# EAGLE design 15-15 AC_DC_Dual_power_supply (EAGLE 9.6.2)
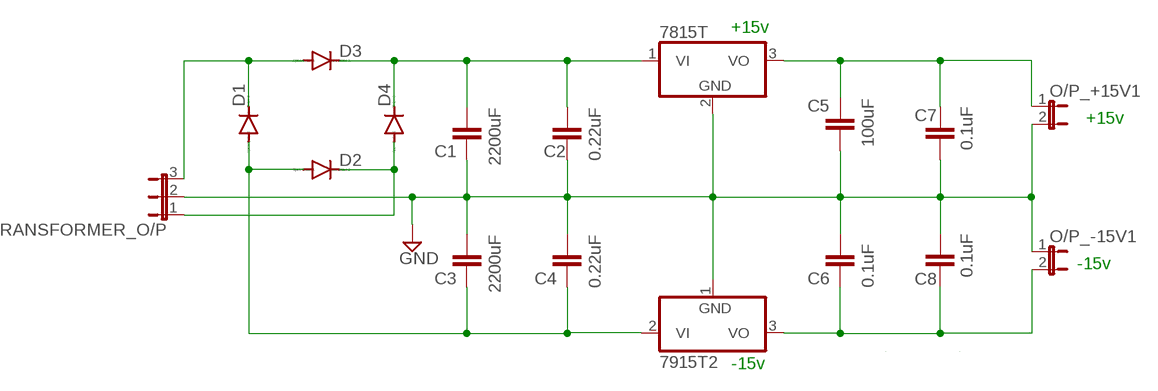
[diagram p0: schematic, sheet 1]

## Parts
7915T2  7915T  [TO220H]
+15V2  7815T  [TO220H]
C1  2200uF  C2.5/2  [C2.5-2]
C2  0.22uF  C2.5/2  [C2.5-2]
C3  2200uF  C2.5/2  [C2.5-2]
C4  0.22uF  C2.5/2  [C2.5-2]
C5  100uF  C2.5/2  [C2.5-2]
C6  0.1uF  C2.5/2  [C2.5-2]
C7  0.1uF  C2,5-3  [C2.5-3]
C8  0.1uF  C2,5-3  [C2.5-3]
D1  1N4004  [DO41-10]
D2  1N4004  [DO41-10]
D3  1N4004  [DO41-10]
D4  1N4004  [DO41-10]
O/P_+15V1  JP1E  [JP1]
O/P_-15V1  JP1E  [JP1]
TRANSFORMER_O/P  JP2E  [JP2]

## Nets
GND: 7915T2.1(GND) +15V2.2(GND) C1.1 C2.1 C3.2 C4.2 C5.1 C6.2 C7.2 C8.1 TRANSFORMER_O/P.2
N$3: +15V2.1(VI) C1.2 C2.2 D3.C D4.C
N$7: +15V2.3(VO) C5.2 C7.1 O/P_+15V1.1
N$8: 7915T2.3(VO) C6.1
N$9: C8.2 O/P_-15V1.2
N$10: 7915T2.2(VI) C3.1 C4.1 D1.A D2.A
N$13: D2.C D4.A TRANSFORMER_O/P.1
N$19: O/P_+15V1.2 O/P_-15V1.1
N$20: D1.C D3.A TRANSFORMER_O/P.3

## Notes on the sheet
- +15v
- +15v
- -15v
- -15v

## Library data of the parts
7915T2 = linear:79*: Negative VOLTAGE REGULATOR
+15V2 = linear:78*: Positive VOLTAGE REGULATOR Source: http://cache.national.com/ds/LM/LM78L05.pdf http://www.fairchildsemi.com/ds/LM/LM7805.pdf
C1-C8 = capacitor-wima:C: CAPACITOR naming: grid - package width
D1-D4 = diode:1N4004: DIODE general purpose rectifier, 1 A
O/P_+15V1 O/P_-15V1 = jumper:JP1E: JUMPER
TRANSFORMER_O/P = jumper:JP2E: JUMPER

## Board
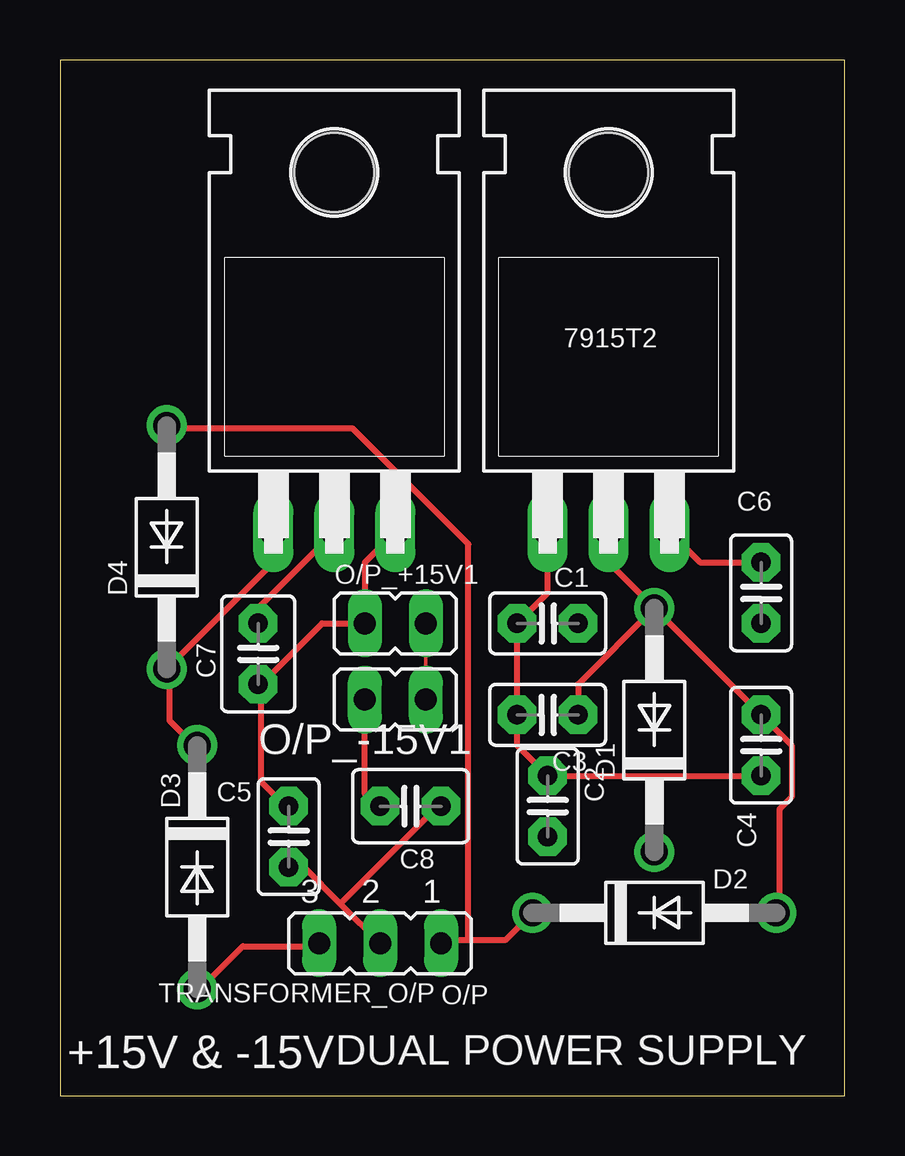
[diagram p1: board, top side]
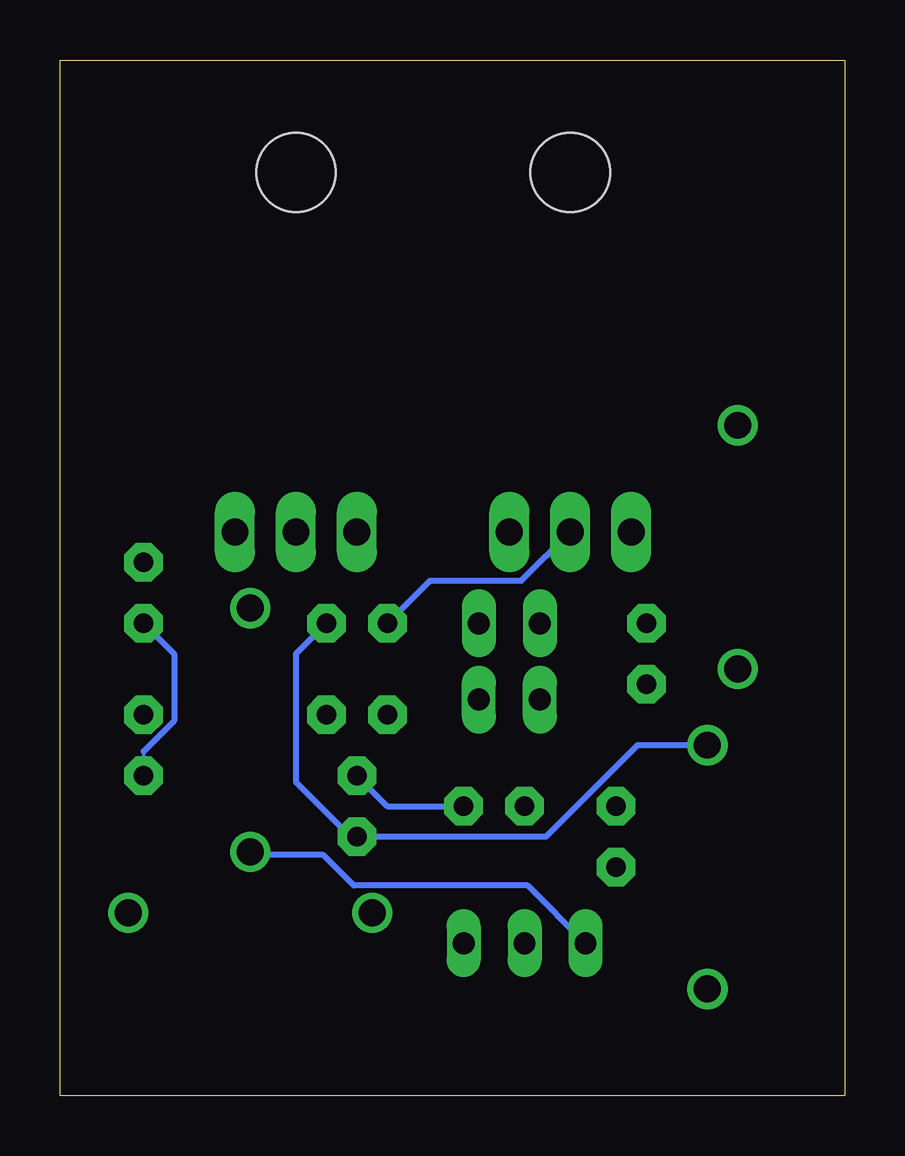
[diagram p2: board, bottom side, seen from below]

Size 32.69 x 43.17 mm. Coordinates in mm from the lower left corner, seen from the top.
Outline: 0,0 32.69,0 32.69,43.17 0,43.17 0,0
Copper layers (1*16): Top 0.035mm / dielectric 1.5mm / Bottom 0.035mm
Design rules "default": minimum track width 6mil, minimum drill 0.35mm, track to track 6mil, track to pad 6mil, pad to pad 6mil, via to via 6mil, smd to smd 6mil, copper to edge 40mil, drill to drill 6mil, minimum pad ring 10mil, minimum via ring 8mil, stop-mask expansion 4mil, vias tented up to drill 0mil, thermal gap 10mil

### Footprints (pad centres in the part's own frame; a part is rotated, then mirrored left to right if it is on the bottom)
TO220H = drill 1.118 long: 1 -2.54,-10.16; 2 0,-10.16; 3 2.54,-10.16 | hole 3.302: 0,4.826
C2.5-2 = drill 0.813 pad 1.6 octagon: 1 -1.27,0; 2 1.27,0
C2.5-3 = drill 0.813 pad 1.6 octagon: 1 -1.27,0; 2 1.27,0
DO41-10 = drill 1.118: A 5.08,0; C -5.08,0
JP1 = drill 0.914 long: 1 0,-1.27; 2 0,1.27
JP2 = drill 0.914 long: 1 -2.54,0; 2 0,0; 3 2.54,0

### Placement (x,y rotation side)
7915T2  22.86,33.66 0 top
+15V2  11.43,33.66 0 top
C1  20.32,19.68 0 top
C2  20.32,12.07 270 top
C3  20.32,15.88 180 top
C4  29.21,14.61 270 top
C5  9.53,10.79 90 top
C6  29.21,20.96 270 top
C7  8.26,18.42 90 top
C8  14.61,12.07 180 top
D1  24.77,15.24 90 top
D2  24.77,7.62 0 top
D3  5.71,9.52 270 top
D4  4.45,22.86 90 top
O/P_+15V1  13.97,19.68 270 top
O/P_-15V1  13.97,16.51 90 top
TRANSFORMER_O/P  13.34,6.35 180 top

### Tracks (layer width: path | path; a pad name or v marks a point on that pad's centre or on a via)
GND
  Top 0.152: 8.38,20.45 8.38,19.68 C7.2 | 15.75,12.07 C8.1
  Top 0.254: +15V2.2 8.38,20.45 | 11.68,8 10.16,9.52 C5.1 | 11.68,8 TRANSFORMER_O/P.2 | 7915T2.1 20.32,20.96 C1.1 C3.2 19.05,14.61 C2.1 C4.2 | 15.75,12.07 11.68,8
  Bottom 0.152: 29.21,14.35 C4.2
  Bottom 0.254: 29.21,14.35 27.94,15.62 27.94,18.42 C6.2 | C8.1 19.05,12.07 C2.1 | +15V2.2 13.46,21.46 17.27,21.46 C1.1
N$3
  Top 0.152: 4.57,17.65 D4.C | 5.59,14.61 D3.C
  Top 0.254: 4.57,17.65 4.57,15.62 5.59,14.61 | +15V2.1 8.89,22.22 D4.C
  Bottom 0.254: C1.2 22.86,18.42 22.86,13.08 20.57,10.79 C2.2 12.45,10.79 8.64,14.61 D3.C
N$7
  Top 0.152: 9.4,12.07 C5.2 | 8.38,17.14 C7.1
  Top 0.254: +15V2.3 12.7,22.22 O/P_+15V1.1 10.92,19.68 8.38,17.14 8.38,13.08 9.4,12.07
N$8
  Top 0.254: C6.1 26.67,22.22 7915T2.3
N$9
  Top 0.254: O/P_-15V1.2 12.7,12.57 13.21,12.07 C8.2
N$10
  Top 0.152: 29.97,7.75 D2.A
  Top 0.254: C3.1 21.59,17.14 D1.A | D1.A C4.1 30.48,14.61 30.48,12.45 29.97,11.94 29.97,7.75 | 7915T2.2 22.86,22.22 D1.A
N$13
  Top 0.152: 4.57,27.81 D4.A
  Top 0.254: 17.02,6.48 18.54,6.48 D2.C | 17.02,6.48 16,6.48 TRANSFORMER_O/P.1 | 4.57,27.81 12.19,27.81 17.02,22.99 17.02,6.48
N$19
  Top 0.152: O/P_+15V1.2 O/P_-15V1.1
N$20
  Top 0.152: 10.67,6.22 TRANSFORMER_O/P.3 | 5.84,4.45 D3.A
  Top 0.254: 10.67,6.22 7.62,6.22 5.84,4.45
  Bottom 0.152: 24.64,10.03 D1.C
  Bottom 0.254: 24.64,10.03 21.72,10.03 20.45,8.76 13.21,8.76 TRANSFORMER_O/P.3

### Text on the board
tPlace: O/P | +15V & -15V | DUAL POWER SUPPLY